# EAGLE schematic nixie (EAGLE 7.6.0)
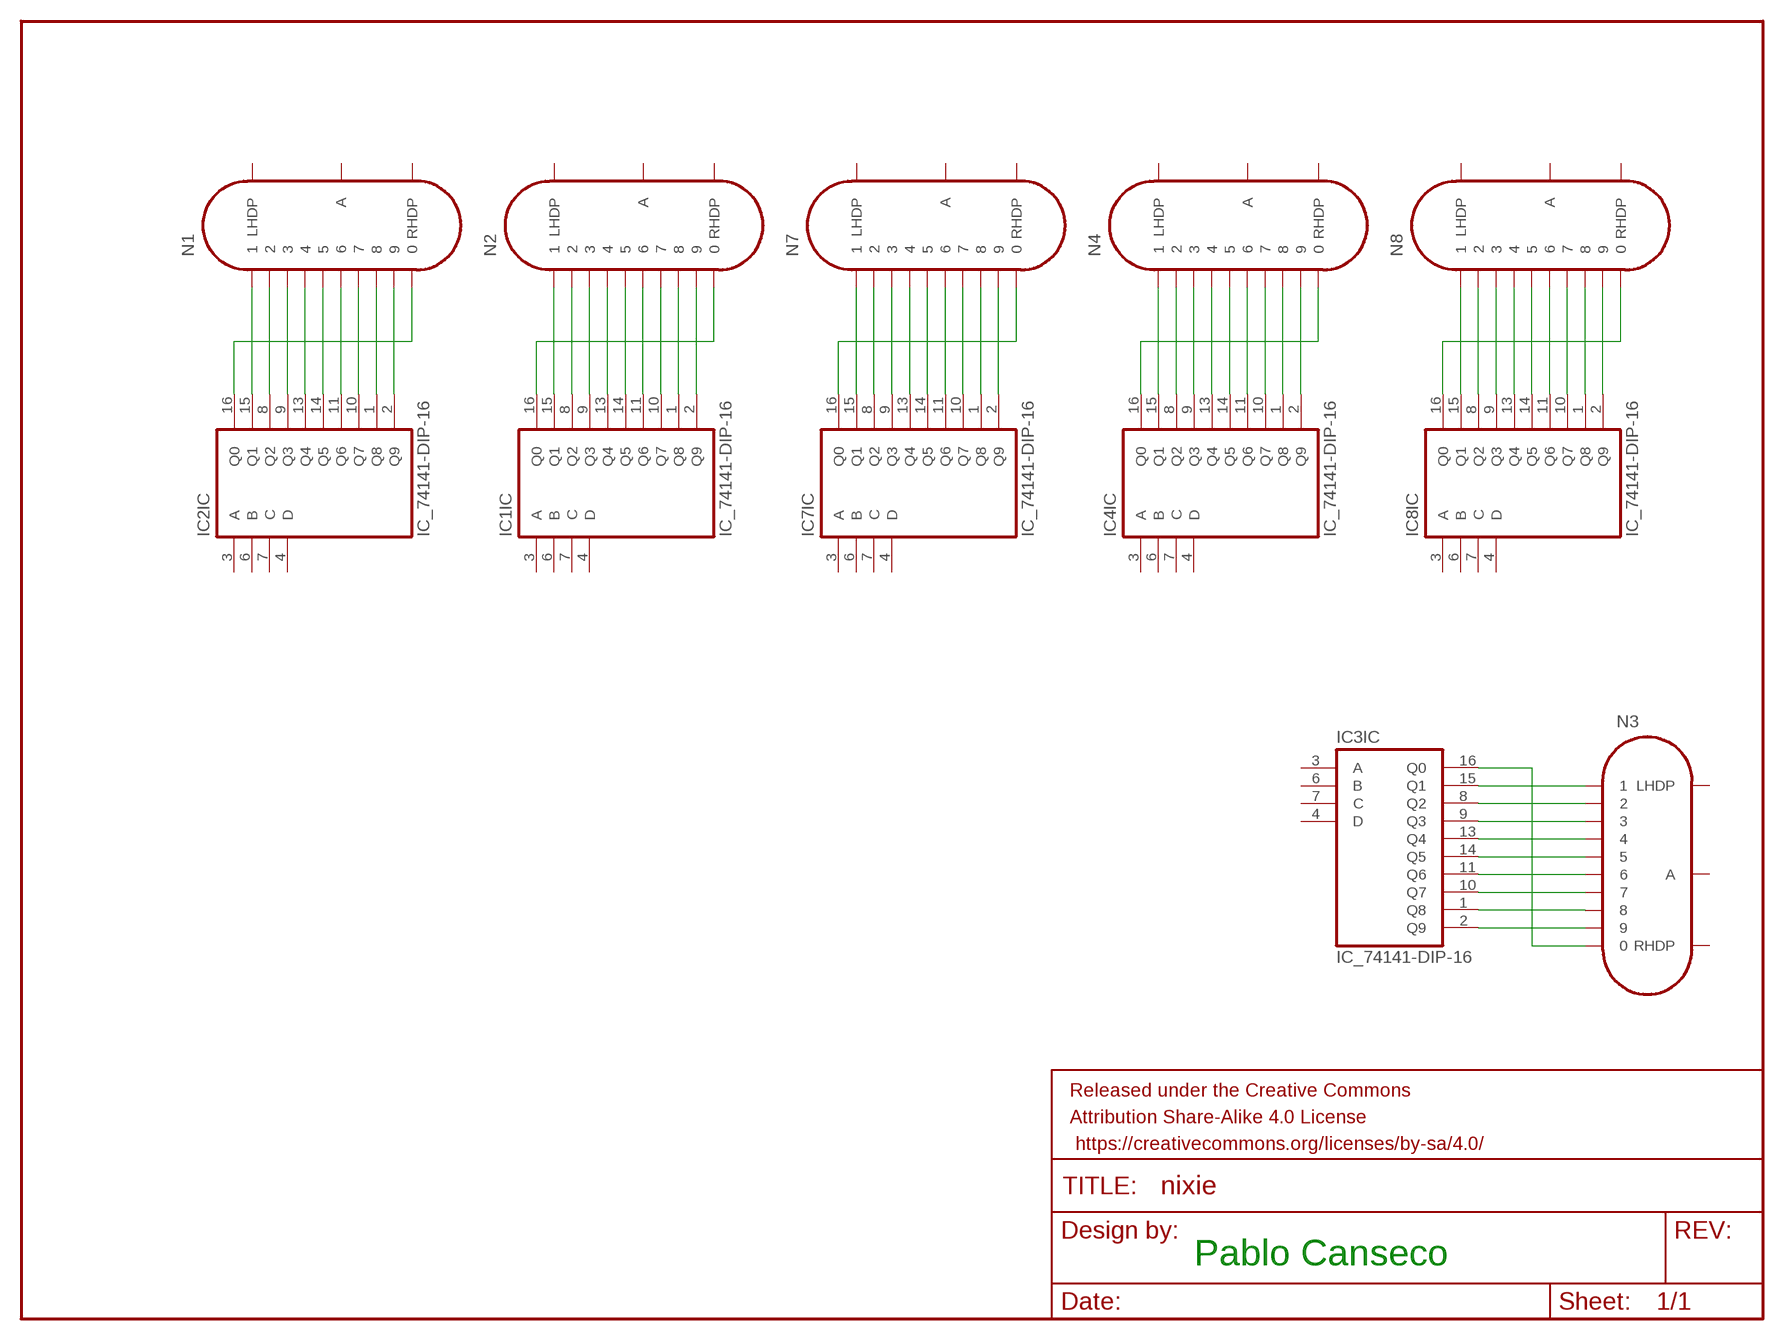
[diagram p0: schematic, sheet 1]

## Parts
FRAME1  FRAME-LETTER  [CREATIVE_COMMONS]
IC1  IC_74141-DIP-16  [DIL16]
IC2  IC_74141-DIP-16  [DIL16]
IC3  IC_74141-DIP-16  [DIL16]
IC4  IC_74141-DIP-16  [DIL16]
IC7  IC_74141-DIP-16  [DIL16]
IC8  IC_74141-DIP-16  [DIL16]
N1  IN-16  [IN-16]
N2  IN-16  [IN-16]
N3  IN-16  [IN-16]
N4  IN-16  [IN-16]
N7  IN-16  [IN-16]
N8  IN-16  [IN-16]

## Nets
N$1: IC2.15(IC:Q1) N1.1
N$2: IC2.8(IC:Q2) N1.2
N$3: IC2.9(IC:Q3) N1.3
N$4: IC2.13(IC:Q4) N1.4
N$5: IC2.14(IC:Q5) N1.5
N$6: IC2.11(IC:Q6) N1.6
N$7: IC2.10(IC:Q7) N1.7
N$8: IC2.1(IC:Q8) N1.8
N$9: IC2.2(IC:Q9) N1.9
N$10: IC2.16(IC:Q0) N1.0
N$11: IC1.15(IC:Q1) N2.1
N$12: IC1.8(IC:Q2) N2.2
N$13: IC1.9(IC:Q3) N2.3
N$14: IC1.13(IC:Q4) N2.4
N$15: IC1.14(IC:Q5) N2.5
N$16: IC1.11(IC:Q6) N2.6
N$17: IC1.10(IC:Q7) N2.7
N$18: IC1.1(IC:Q8) N2.8
N$19: IC1.2(IC:Q9) N2.9
N$20: IC1.16(IC:Q0) N2.0
N$21: IC4.15(IC:Q1) N4.1
N$22: IC4.8(IC:Q2) N4.2
N$23: IC4.9(IC:Q3) N4.3
N$24: IC4.13(IC:Q4) N4.4
N$25: IC4.14(IC:Q5) N4.5
N$26: IC4.11(IC:Q6) N4.6
N$27: IC4.10(IC:Q7) N4.7
N$28: IC4.1(IC:Q8) N4.8
N$29: IC4.2(IC:Q9) N4.9
N$30: IC4.16(IC:Q0) N4.0
N$31: IC7.15(IC:Q1) N7.1
N$32: IC7.8(IC:Q2) N7.2
N$33: IC7.9(IC:Q3) N7.3
N$34: IC7.13(IC:Q4) N7.4
N$35: IC7.14(IC:Q5) N7.5
N$36: IC7.11(IC:Q6) N7.6
N$37: IC7.10(IC:Q7) N7.7
N$38: IC7.1(IC:Q8) N7.8
N$39: IC7.2(IC:Q9) N7.9
N$40: IC7.16(IC:Q0) N7.0
N$41: IC8.15(IC:Q1) N8.1
N$42: IC8.8(IC:Q2) N8.2
N$43: IC8.9(IC:Q3) N8.3
N$44: IC8.13(IC:Q4) N8.4
N$45: IC8.14(IC:Q5) N8.5
N$46: IC8.11(IC:Q6) N8.6
N$47: IC8.10(IC:Q7) N8.7
N$48: IC8.1(IC:Q8) N8.8
N$49: IC8.2(IC:Q9) N8.9
N$50: IC8.16(IC:Q0) N8.0
N$51: IC3.15(IC:Q1) N3.1
N$52: IC3.8(IC:Q2) N3.2
N$53: IC3.9(IC:Q3) N3.3
N$54: IC3.13(IC:Q4) N3.4
N$55: IC3.14(IC:Q5) N3.5
N$56: IC3.11(IC:Q6) N3.6
N$57: IC3.10(IC:Q7) N3.7
N$58: IC3.1(IC:Q8) N3.8
N$59: IC3.2(IC:Q9) N3.9
N$60: IC3.16(IC:Q0) N3.0
Unconnected: IC1.3(IC:A) IC1.4(IC:D) IC1.5(SUPPLY:V+) IC1.6(IC:B) IC1.7(IC:C) IC1.12(SUPPLY:GND) IC2.3(IC:A) IC2.4(IC:D) IC2.5(SUPPLY:V+) IC2.6(IC:B) IC2.7(IC:C) IC2.12(SUPPLY:GND) IC3.3(IC:A) IC3.4(IC:D) IC3.5(SUPPLY:V+) IC3.6(IC:B) IC3.7(IC:C) IC3.12(SUPPLY:GND) IC4.3(IC:A) IC4.4(IC:D) IC4.5(SUPPLY:V+) IC4.6(IC:B) IC4.7(IC:C) IC4.12(SUPPLY:GND) IC7.3(IC:A) IC7.4(IC:D) IC7.5(SUPPLY:V+) IC7.6(IC:B) IC7.7(IC:C) IC7.12(SUPPLY:GND) IC8.3(IC:A) IC8.4(IC:D) IC8.5(SUPPLY:V+) IC8.6(IC:B) IC8.7(IC:C) IC8.12(SUPPLY:GND) N1.A N1.LHDP N1.RHDP N2.A N2.LHDP N2.RHDP N3.A N3.LHDP N3.RHDP N4.A N4.LHDP N4.RHDP N7.A N7.LHDP N7.RHDP N8.A N8.LHDP N8.RHDP

## Notes on the sheet
- Pablo Canseco

## Library data of the parts
FRAME1 = SparkFun-Aesthetics:FRAME-LETTER: Schematic Frame Standard 8.5x11 US Letter frame
IC1-IC4 IC7 IC8 = dp_devices.v6:IC_74141: BCD to decimal decoder
N1-N4 N7 N8 = russian-nixies:IN-16: IN-16: small numeric frontview nixie tube